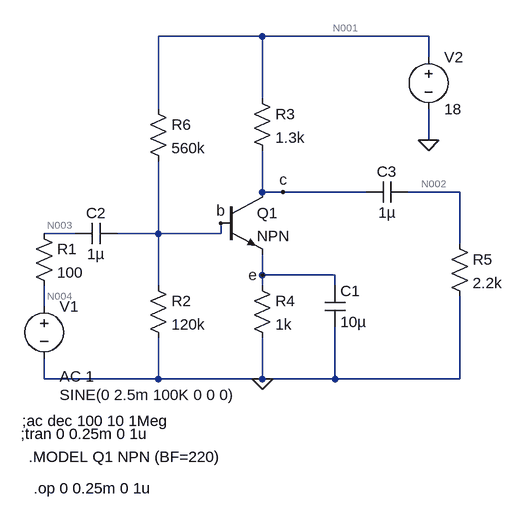
[diagram p0: schematic Draft1.asc]
Draft1.asc, the LTspice schematic file:
Version 4
SHEET 1 880 680
WIRE 368 -256 208 -256
WIRE 624 -256 368 -256
WIRE 624 -224 624 -256
WIRE 368 -160 368 -256
WIRE 208 -144 208 -256
WIRE 624 -96 624 -144
WIRE 368 -16 368 -80
WIRE 400 -16 368 -16
WIRE 528 -16 400 -16
WIRE 672 -16 592 -16
WIRE 80 48 32 48
WIRE 208 48 208 -64
WIRE 208 48 144 48
WIRE 304 48 304 32
WIRE 304 48 208 48
WIRE 672 64 672 -16
WIRE 368 112 368 80
WIRE 480 112 368 112
WIRE 208 128 208 48
WIRE 368 128 368 112
WIRE 480 128 480 112
WIRE 32 160 32 128
WIRE 32 272 32 240
WIRE 208 272 208 208
WIRE 208 272 32 272
WIRE 368 272 368 208
WIRE 368 272 208 272
WIRE 480 272 480 192
WIRE 480 272 368 272
WIRE 672 272 672 144
WIRE 672 272 480 272
FLAG 368 272 0
FLAG 624 -96 0
FLAG 400 -16 c
FLAG 368 112 e
FLAG 304 32 b
SYMBOL voltage 32 144 R0
WINDOW 3 24 152 Left 2
WINDOW 123 24 124 Left 2
WINDOW 39 0 0 Left 0
SYMATTR InstName V1
SYMATTR Value SINE(0 2.5m 100K 0 0 0)
SYMATTR Value2 AC 1
SYMBOL res 16 32 R0
SYMATTR InstName R1
SYMATTR Value 100
SYMBOL res 192 112 R0
SYMATTR InstName R2
SYMATTR Value 120k
SYMBOL res 352 -176 R0
SYMATTR InstName R3
SYMATTR Value 1.3k
SYMBOL res 352 112 R0
SYMATTR InstName R4
SYMATTR Value 1k
SYMBOL res 656 48 R0
SYMATTR InstName R5
SYMATTR Value 2.2k
SYMBOL cap 464 128 R0
SYMATTR InstName C1
SYMATTR Value 10µ
SYMBOL cap 144 32 R90
WINDOW 0 0 32 VBottom 2
WINDOW 3 32 32 VTop 2
SYMATTR InstName C2
SYMATTR Value 1µ
SYMBOL cap 592 -32 R90
WINDOW 0 0 32 VBottom 2
WINDOW 3 32 32 VTop 2
SYMATTR InstName C3
SYMATTR Value 1µ
SYMBOL voltage 624 -240 R0
WINDOW 123 0 0 Left 0
WINDOW 39 0 0 Left 0
SYMATTR InstName V2
SYMATTR Value 18
SYMBOL res 192 -160 R0
SYMATTR InstName R6
SYMATTR Value 560k
SYMBOL npn 304 -16 R0
SYMATTR InstName Q1
TEXT -2 336 Left 2 !;ac dec 100 10 1Meg
TEXT -4 356 Left 2 !;tran 0 0.25m 0 1u
TEXT 8 392 Left 2 !.MODEL Q1 NPN (BF=220)
TEXT 16 440 Left 2 !.op 0 0.25m 0 1u

The netlist it stands for:
* Draft1.asc
V1 N004 0 SINE(0 2.5m 100K 0 0 0) AC 1
R1 N003 N004 100
R2 b 0 120k
R3 N001 c 1.3k
R4 e 0 1k
R5 N002 0 2.2k
C1 e 0 10µ
C2 b N003 1µ
C3 N002 c 1µ
V2 N001 0 18
R6 N001 b 560k
Q1 c b e 0 NPN
.model NPN NPN
.model PNP PNP
.lib standard.bjt
;ac dec 100 10 1Meg
;tran 0 0.25m 0 1u
.MODEL Q1 NPN (BF=220)
.op 0 0.25m 0 1u
.backanno
.end

* Results of the author's LTspice run, read from the files saved beside the schematic
* Operating Point:
*   V(n004) = 0 V
*   V(n003) = 0 V
*   V(b) = 1.991 V
*   V(n001) = 18 V
*   V(c) = 16.44 V
*   V(e) = 1.212 V
*   V(n002) = 36.17 fV
*   Ic(Q1) = 1.2 mA
*   Ib(Q1) = 12 µA
*   Ie(Q1) = -1.212 mA
*   I(C3) = 0 A
*   I(C2) = 0 A
*   I(C1) = 0 A
*   I(R6) = 28.59 µA
*   I(R5) = 0 A
*   I(R4) = 1.212 mA
*   I(R3) = 1.2 mA
*   I(R2) = 16.59 µA
*   I(R1) = 0 A
*   I(V2) = -1.228 mA
*   I(V1) = 0 A
* From the log:
*   Semiconductor Device Operating Points:
*                           --- Bipolar Transistors ---
*   Name:       q1
*   Model:      npn
*   Ib:       1.20e-05
*   Ic:       1.20e-03
*   Vbe:      7.79e-01
*   Vbc:     -1.44e+01
*   Vce:      1.52e+01
*   BetaDC:   1.00e+02
*   Gm:       4.64e-02
*   Rpi:      2.16e+03
*   Rx:       0.00e+00
*   Ro:       0.00e+00
*   Cbe:      0.00e+00
*   Cbc:      0.00e+00
*   Cjs:      0.00e+00
*   BetaAC:   1.00e+02
*   Cbx:      0.00e+00
*   Ft:       0.00e+00